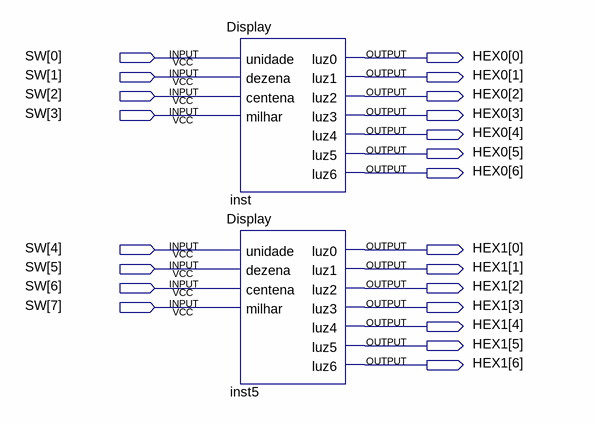
[diagram p0: schematic sheet]
// Quartus schematic Hexa.bdf as structural Verilog: 2 symbols, 22 pins
module Hexa (
  input  [7:0] SW,
  output [6:0] HEX0,
  output [6:0] HEX1
);

  Display inst (
    .unidade(SW[0]), .dezena(SW[1]), .centena(SW[2]), .milhar(SW[3]), .luz0(HEX0[0]), .luz1(HEX0[1]),
    .luz2(HEX0[2]), .luz3(HEX0[3]), .luz4(HEX0[4]), .luz5(HEX0[5]), .luz6(HEX0[6]));
  Display inst5 (
    .unidade(SW[4]), .dezena(SW[5]), .centena(SW[6]), .milhar(SW[7]), .luz0(HEX1[0]), .luz1(HEX1[1]),
    .luz2(HEX1[2]), .luz3(HEX1[3]), .luz4(HEX1[4]), .luz5(HEX1[5]), .luz6(HEX1[6]));
endmodule
